# Altium project WiDSO.PrjPcb
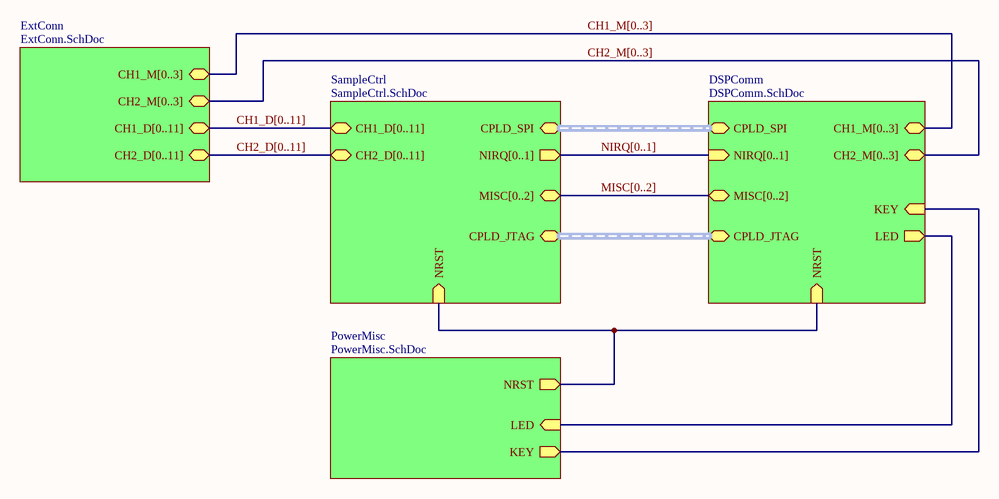
[diagram p0: WiDSO.SchDoc]
5 sheets, 45 parts. Net scope: hierarchical (ports join the sheet entries above them; power ports are global).
Board file: WiDSO.PcbDoc
Sheets:
  WiDSO.SchDoc
    ExtConn = ExtConn.SchDoc
    SampleCtrl = SampleCtrl.SchDoc
    DSPComm = DSPComm.SchDoc
    PowerMisc = PowerMisc.SchDoc

## Sheet WiDSO.SchDoc
size A4

### Sub-sheets
DSPComm = DSPComm.SchDoc: CPLD_SPI (harness SPI), NIRQ[0..1] (in), MISC[0..2] (bidir), CPLD_JTAG (harness JTAG), CH1_M[0..3] (bidir), CH2_M[0..3] (bidir), LED (out), KEY (in), NRST (in)
ExtConn = ExtConn.SchDoc: CH1_D[0..11] (bidir), CH2_D[0..11] (bidir), CH1_M[0..3] (bidir), CH2_M[0..3] (bidir)
PowerMisc = PowerMisc.SchDoc: LED (in), KEY (out), NRST (out)
SampleCtrl = SampleCtrl.SchDoc: CH1_D[0..11] (bidir), CH2_D[0..11] (bidir), CPLD_SPI (harness SPI), NIRQ[0..1] (out), MISC[0..2] (bidir), CPLD_JTAG (harness JTAG), NRST (in)

### Nets
NRST: sheet SampleCtrl/NRST, sheet DSPComm/NRST, sheet PowerMisc/NRST
NetC4_1: sheet DSPComm/KEY, sheet PowerMisc/KEY
NetU4_29: sheet DSPComm/LED, sheet PowerMisc/LED

### Buses and harness runs
bus CH1_D[0..11] = sheet ExtConn/CH1_D[0..11] = sheet SampleCtrl/CH1_D[0..11]
bus CH1_M[0..3] = sheet DSPComm/CH1_M[0..3] = sheet ExtConn/CH1_M[0..3]
bus CH2_D[0..11] = sheet ExtConn/CH2_D[0..11] = sheet SampleCtrl/CH2_D[0..11]
bus CH2_M[0..3] = sheet DSPComm/CH2_M[0..3] = sheet ExtConn/CH2_M[0..3]
bus MISC[0..2] = sheet DSPComm/MISC[0..2] = sheet SampleCtrl/MISC[0..2]
bus NIRQ[0..1] = sheet DSPComm/NIRQ[0..1] = sheet SampleCtrl/NIRQ[0..1]
harness sheet DSPComm/CPLD_JTAG = sheet SampleCtrl/CPLD_JTAG
harness sheet DSPComm/CPLD_SPI = sheet SampleCtrl/CPLD_SPI

## Sheet ExtConn.SchDoc
size A4
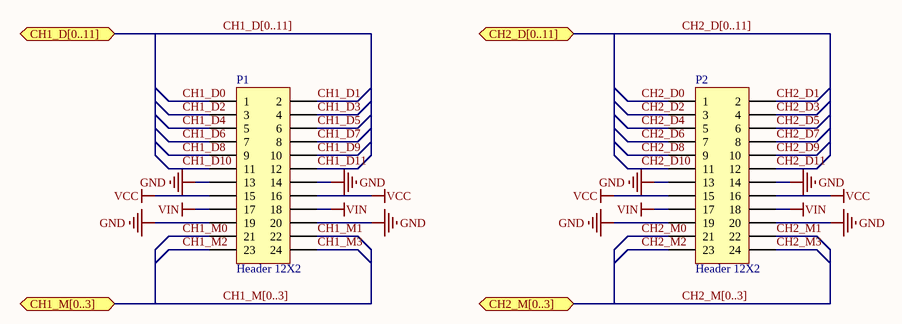
[diagram p1: ExtConn.SchDoc]

### Parts
P1  Header 12X2  [HDR2X12]
P2  Header 12X2  [HDR2X12]

### Ports
CH1_D[0..11] (bidir), CH1_M[0..3] (bidir), CH2_D[0..11] (bidir), CH2_M[0..3] (bidir)

### Nets
GND: P1.13 P1.14 P1.19 P1.20 P2.13 P2.14 P2.19 P2.20
VCC: P1.15 P1.16 P2.15 P2.16
VIN: P1.17 P1.18 P2.17 P2.18
CH1_D0: P1.1
CH1_D1: P1.2
CH1_D2: P1.3
CH1_D3: P1.4
CH1_D4: P1.5
CH1_D5: P1.6
CH1_D6: P1.7
CH1_D7: P1.8
CH1_D8: P1.9
CH1_D9: P1.10
CH1_D10: P1.11
CH1_D11: P1.12
CH1_M0: P1.21
CH1_M1: P1.22
CH1_M2: P1.23
CH1_M3: P1.24
CH2_D0: P2.1
CH2_D1: P2.2
CH2_D2: P2.3
CH2_D3: P2.4
CH2_D4: P2.5
CH2_D5: P2.6
CH2_D6: P2.7
CH2_D7: P2.8
CH2_D8: P2.9
CH2_D9: P2.10
CH2_D10: P2.11
CH2_D11: P2.12
CH2_M0: P2.21
CH2_M1: P2.22
CH2_M2: P2.23
CH2_M3: P2.24

### Buses and harness runs
bus CH1_D[0..11] = port CH1_D[0..11]
bus CH1_M[0..3] = port CH1_M[0..3]
bus CH2_D[0..11] = port CH2_D[0..11]
bus CH2_M[0..3] = port CH2_M[0..3]

### Library data of the parts
P1 P2 = Header 12X2: Header, 12-Pin, Dual row; LatestRevisionDate: 17-Jul-2002; LatestRevisionNote: Re-released for DXP Platform.; Publisher: Altium Limited

## Sheet SampleCtrl.SchDoc
size A4
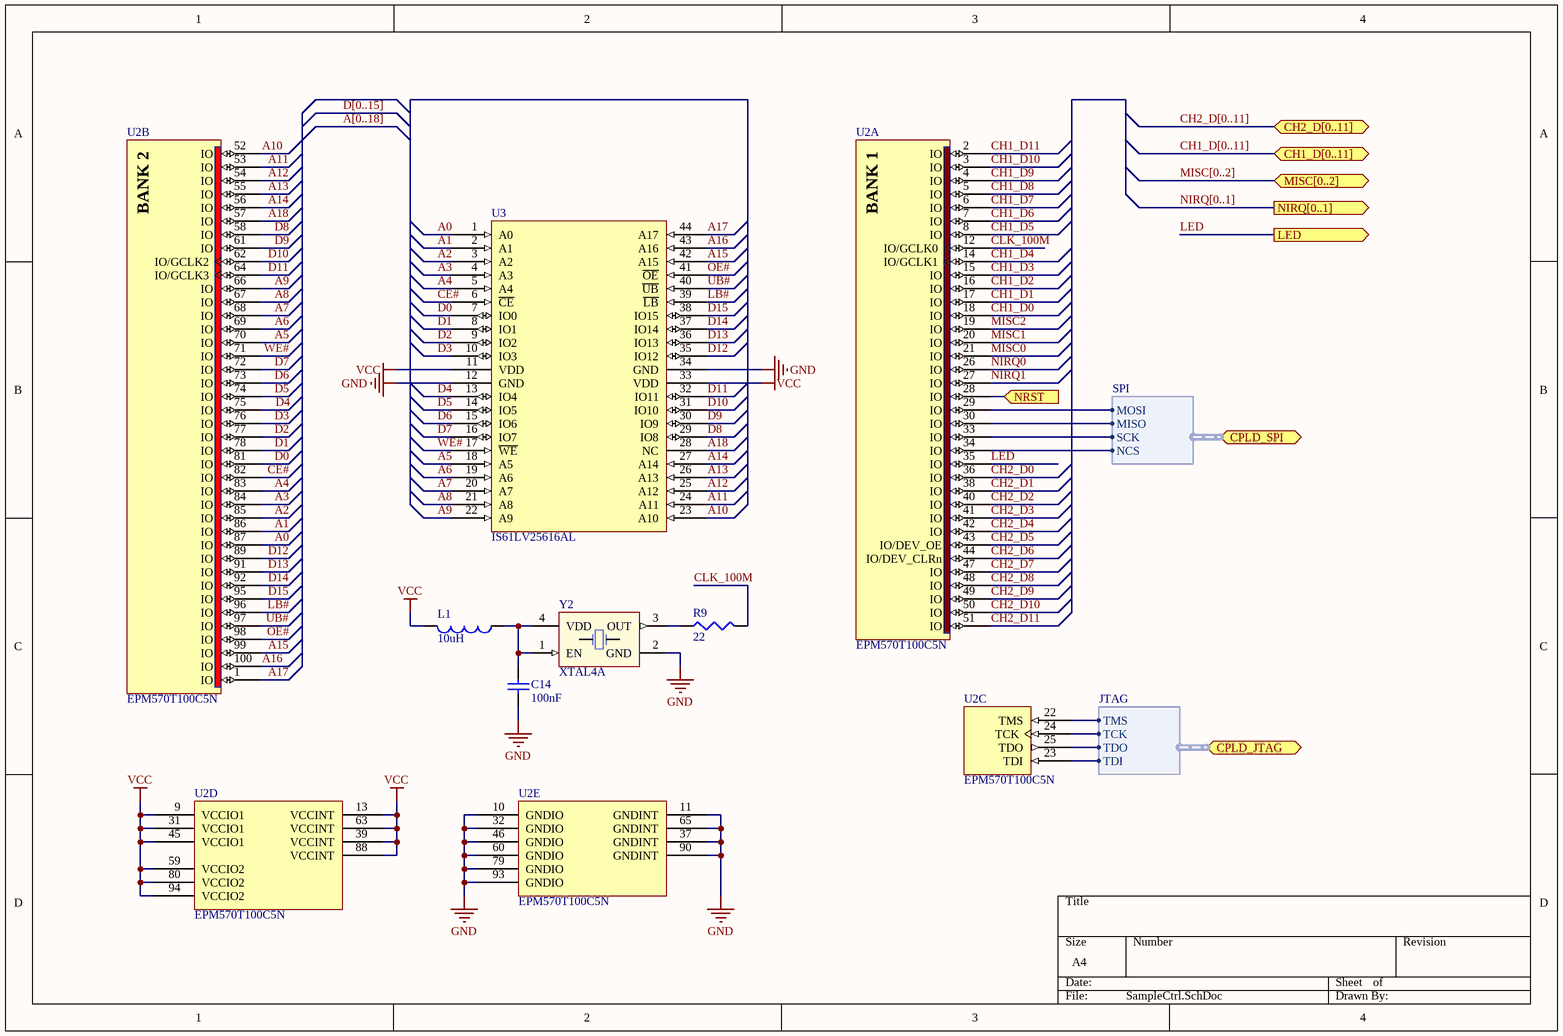
[diagram p2: SampleCtrl.SchDoc]

### Parts
C14  value 100nF  [0603C]  (hidden comment: Cap)
L1  value 10uH  [0805L]  (hidden comment: Inductor)
R9  value 22  [0603R]  (hidden comment: Res3)
U2  EPM570T100C5N  [TQFP100_N]  (parts A,B,C,D,E of 5)
U3  IS61LV25616AL  [TSOP-2L]
Y2  XTAL4A  [XTAL_7050_4P]

### Ports
CH1_D[0..11] (bidir), CH2_D[0..11] (bidir), CPLD_JTAG (harness JTAG), CPLD_SPI (harness SPI), LED (out), MISC[0..2] (bidir), NIRQ[0..1] (out), NRST (in)

### Harnesses
JTAG: TDI, TDO, TCK, TMS
SPI: MOSI, MISO, SCK, NCS

### Nets
GND: C14.2 U2.10(GNDIO) U2.11(GNDINT) U2.32(GNDIO) U2.37(GNDINT) U2.46(GNDIO) U2.60(GNDIO) U2.65(GNDINT) U2.79(GNDIO) U2.90(GNDINT) U2.93(GNDIO) U3.12(GND) U3.34(GND) Y2.2(GND)
VCC: L1.2 U2.9(VCCIO1) U2.13(VCCINT) U2.31(VCCIO1) U2.39(VCCINT) U2.45(VCCIO1) U2.59(VCCIO2) U2.63(VCCINT) U2.80(VCCIO2) U2.88(VCCINT) U2.94(VCCIO2) U3.11(VDD) U3.33(VDD)
A0: U2.87(IO) U3.1(A0)
A1: U2.86(IO) U3.2(A1)
A2: U2.85(IO) U3.3(A2)
A3: U2.84(IO) U3.4(A3)
A4: U2.83(IO) U3.5(A4)
A5: U2.70(IO) U3.18(A5)
A6: U2.69(IO) U3.19(A6)
A7: U2.68(IO) U3.20(A7)
A8: U2.67(IO) U3.21(A8)
A9: U2.66(IO) U3.22(A9)
A10: U2.52(IO) U3.23(A10)
A11: U2.53(IO) U3.24(A11)
A12: U2.54(IO) U3.25(A12)
A13: U2.55(IO) U3.26(A13)
A14: U2.56(IO) U3.27(A14)
A15: U2.99(IO) U3.42(A15)
A16: U2.100(IO) U3.43(A16)
A17: U2.1(IO) U3.44(A17)
A18: U2.57(IO) U3.28(NC)
CE#: U2.82(IO) U3.6(~{CE})
CH1_D0: U2.18(IO)
CH1_D1: U2.17(IO)
CH1_D2: U2.16(IO)
CH1_D3: U2.15(IO)
CH1_D4: U2.14(IO/GCLK1)
CH1_D5: U2.8(IO)
CH1_D6: U2.7(IO)
CH1_D7: U2.6(IO)
CH1_D8: U2.5(IO)
CH1_D9: U2.4(IO)
CH1_D10: U2.3(IO)
CH1_D11: U2.2(IO)
CH2_D0: U2.36(IO)
CH2_D1: U2.38(IO)
CH2_D2: U2.40(IO)
CH2_D3: U2.41(IO)
CH2_D4: U2.42(IO)
CH2_D5: U2.43(IO/DEV_OE)
CH2_D6: U2.44(IO/DEV_CLRn)
CH2_D7: U2.47(IO)
CH2_D8: U2.48(IO)
CH2_D9: U2.49(IO)
CH2_D10: U2.50(IO)
CH2_D11: U2.51(IO)
CLK_100M: R9.2 U2.12(IO/GCLK0)
D0: U2.81(IO) U3.7(IO0)
D1: U2.78(IO) U3.8(IO1)
D2: U2.77(IO) U3.9(IO2)
D3: U2.76(IO) U3.10(IO3)
D4: U2.75(IO) U3.13(IO4)
D5: U2.74(IO) U3.14(IO5)
D6: U2.73(IO) U3.15(IO6)
D7: U2.72(IO) U3.16(IO7)
D8: U2.58(IO) U3.29(IO8)
D9: U2.61(IO) U3.30(IO9)
D10: U2.62(IO/GCLK2) U3.31(IO10)
D11: U2.64(IO/GCLK3) U3.32(IO11)
D12: U2.89(IO) U3.35(IO12)
D13: U2.91(IO) U3.36(IO13)
D14: U2.92(IO) U3.37(IO14)
D15: U2.95(IO) U3.38(IO15)
LB#: U2.96(IO) U3.39(~{LB})
LED: U2.35(IO) ; port LED
MISC0: U2.21(IO)
MISC1: U2.20(IO)
MISC2: U2.19(IO)
NIRQ0: U2.26(IO)
NIRQ1: U2.27(IO)
NRST: U2.28(IO) ; port NRST
OE#: U2.98(IO) U3.41(~{OE})
UB#: U2.97(IO) U3.40(~{UB})
WE#: U2.71(IO) U3.17(~{WE})
NetC14_1: C14.1 L1.1 Y2.1(EN) Y2.4(VDD)
NetR9_1: R9.1 Y2.3(OUT)
NetU2_22: U2.22(TMS) ; port CPLD_JTAG.TMS
NetU2_23: U2.23(TDI) ; port CPLD_JTAG.TDI
NetU2_24: U2.24(TCK) ; port CPLD_JTAG.TCK
NetU2_25: U2.25(TDO) ; port CPLD_JTAG.TDO
NetU2_29: U2.29(IO) ; port CPLD_SPI.MOSI
NetU2_30: U2.30(IO) ; port CPLD_SPI.MISO
NetU2_33: U2.33(IO) ; port CPLD_SPI.SCK
NetU2_34: U2.34(IO) ; port CPLD_SPI.NCS

### Buses and harness runs
bus A[0..18]
bus CH1_D[0..11] = port CH1_D[0..11]
bus CH2_D[0..11] = port CH2_D[0..11]
bus D[0..15]
bus MISC[0..2] = port MISC[0..2]
bus NIRQ[0..1] = port NIRQ[0..1]

### Notes on the sheet
- (in symbol EPM570T100C5N, part A) BANK 1
- (in symbol EPM570T100C5N, part B) BANK 2

### Library data of the parts
C14 = Cap: Capacitor; Published: 8-Jun-2000; LatestRevisionDate: 17-Jul-2002; LatestRevisionNote: Re-released for DXP Platform.; PackageReference: CAPC2012L; Publisher: Altium Limited
L1 = Inductor: Code_IEC: 1005; Published: 8-Jun-2000; LatestRevisionDate: 29-May-2009; LatestRevisionNote: IPC-7351 Footprint Added.; PackageReference: 0402-A; Publisher: Altium Limited; PackageDescription: Chip Inductor; Code_JEITA: 0402
R9 = Res3: Resistor; Published: 8-Jun-2000; LatestRevisionDate: 29-May-2009; LatestRevisionNote: IPC-7351 Footprint Added.; PackageReference: J1-0603; Publisher: Altium Limited; PackageDescription: Chip Resistor
U2 = EPM570T100C5N: MAX II 3.3/2.5V CPLD, 76 IOs, 570 Logic Elements, 100-Pin Plastic TQFP, Commercial Temperature, Speed Grade 5, Pb-Free; Note: Each set of VCCIO pins can be connected to 3.3V, 2.5V, 1.8V, or 1.5V.; Note: All VCCINT pins must be connected to either 3.3V or 2.5V (but not a combination of both).; Published: 4-Mar-2005; LatestRevisionDate: 13-Apr-2006; LatestRevisionNote: IPC-7351 Footprint Added.; DatasheetVersion: ver1.8, Jul-2006; PackageVersion: ver14.3, Jul-2006; PackageReference: TQFP100; Publisher: Altium Limited; PackageDescription: 100-Pin Plastic Thin Quad Flat Pack (TQFP100); Code_JEDEC: MS-026-AED; ComponentLink1Description: Manufacturer Link; ComponentLink1URL: http://www.altera.com/products/devices/cpld/max2/mx2-index.jsp; ComponentLink2Description: Handbook; ComponentLink2URL: http://www.altera.com/literature/hb/max2/max2_mii5v1.pdf; ComponentLink3Description: Packaging Specification; ComponentLink3URL: http://www.altera.com/literature/ds/dspkg.pdf
U3 = IS61LV25616AL: 256K*16 SRAM, 3.3V
Y2 = XTAL4A: 4脚有源晶振

## Sheet DSPComm.SchDoc
size A4
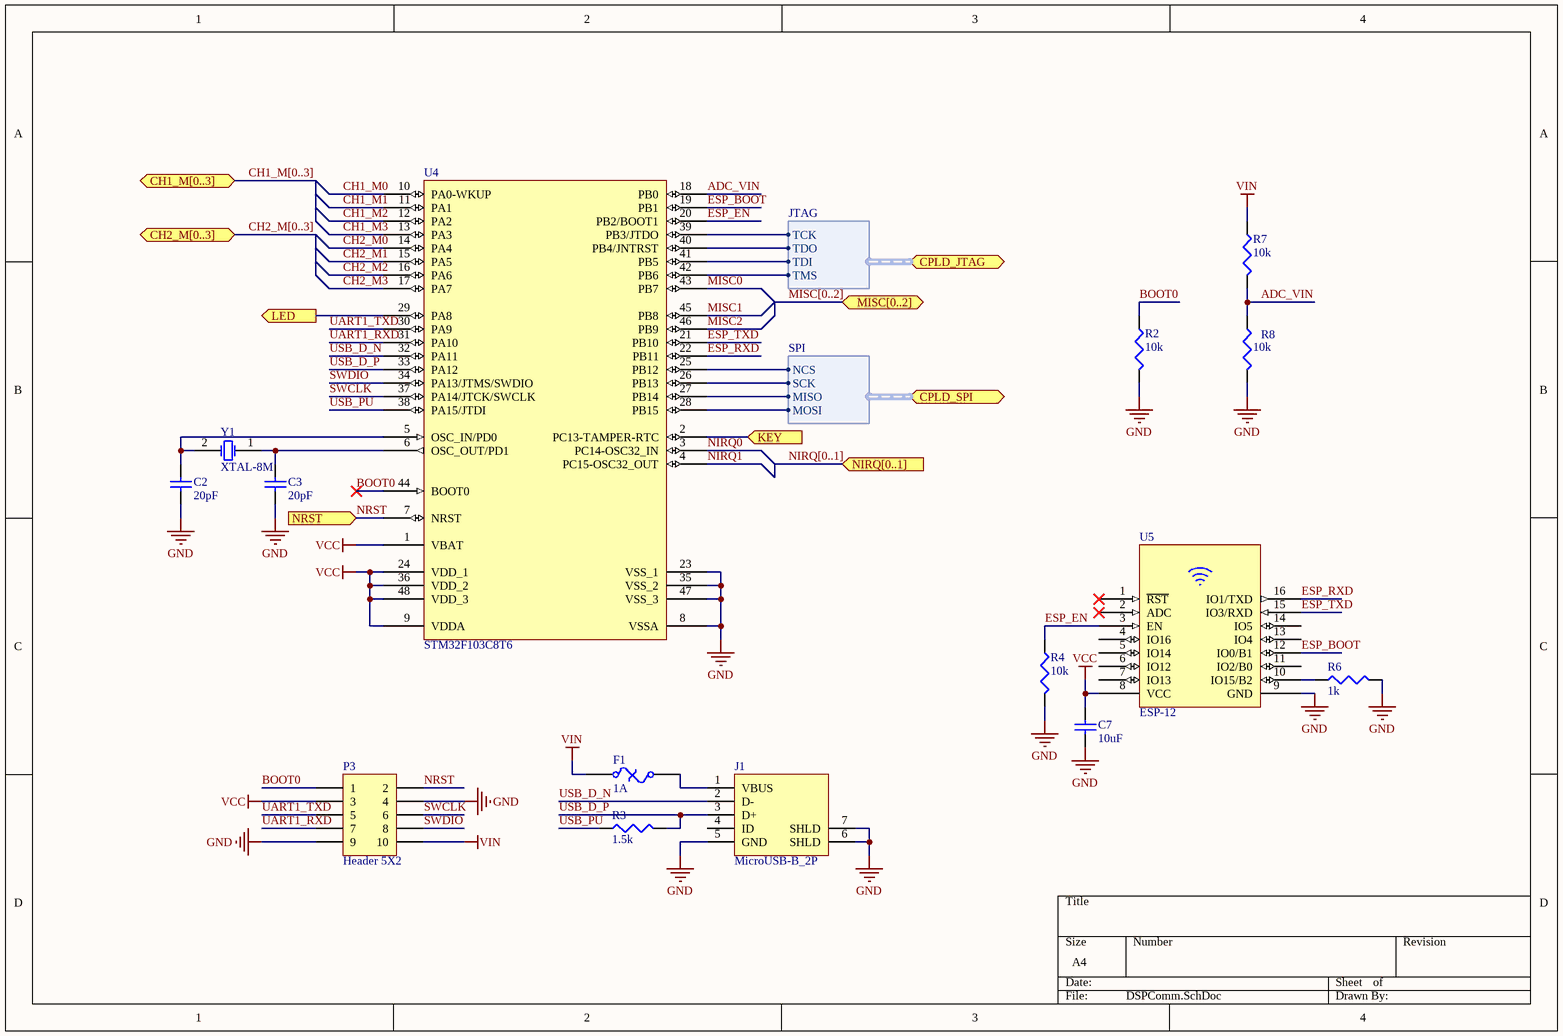
[diagram p3: DSPComm.SchDoc]

### Parts
(Parts that share a designator on the sheet are numbered #1, #2 ... from top to bottom, then left to right.)
C2  value 20pF  [0603C]  (hidden comment: Cap)
C3  value 20pF  [0603C]  (hidden comment: Cap)
C7#1  value 10uF  [0805C]  (hidden comment: Cap)
F1  1A  [1206F]
J1  MicroUSB-B_2P  [MICRO-USB-B-2P]
P3  Header 5X2  [HDR2X5]
R2  value 10k  [0603R]  (hidden comment: Res3)
R3  value 1.5k  [0603R]  (hidden comment: Res3)
R4  value 10k  [0603R]  (hidden comment: Res3)
R6  value 1k  [0603R]  (hidden comment: Res3)
R7  value 10k  [0603R]  (hidden comment: Res3)
R8  value 10k  [0603R]  (hidden comment: Res3)
U4  STM32F103C8T6  [LQFP48_M]
U5  ESP-12  [ESP-12]
Y1  XTAL-8M  [XTAL_5032_2P]

### Ports
CH1_M[0..3] (bidir), CH2_M[0..3] (bidir), CPLD_JTAG (harness JTAG), CPLD_SPI (harness SPI), KEY (in), LED (out), MISC[0..2] (bidir), NIRQ[0..1] (in), NRST (in)

### Harnesses
JTAG: TDI, TDO, TCK, TMS
SPI: MOSI, MISO, SCK, NCS

### Nets
GND: C2.1 C3.1 C7#1.2 J1.5(GND) J1.6(SHLD) J1.7(SHLD) P3.4 P3.9 R2.2 R4.2 R6.2 R8.2 U4.8(VSSA) U4.23(VSS_1) U4.35(VSS_2) U4.47(VSS_3) U5.9(GND)
VCC: C7#1.1 P3.3 U4.1(VBAT) U4.9(VDDA) U4.24(VDD_1) U4.36(VDD_2) U4.48(VDD_3) U5.8(VCC)
VIN: F1.1 P3.10 R7.1
ADC_VIN: R7.2 R8.1 U4.18(PB0)
BOOT0: P3.1 R2.1 U4.44(BOOT0)
CH1_M0: U4.10(PA0-WKUP)
CH1_M1: U4.11(PA1)
CH1_M2: U4.12(PA2)
CH1_M3: U4.13(PA3)
CH2_M0: U4.14(PA4)
CH2_M1: U4.15(PA5)
CH2_M2: U4.16(PA6)
CH2_M3: U4.17(PA7)
ESP_BOOT: U4.19(PB1) U5.12(IO0/B1)
ESP_EN: R4.1 U4.20(PB2/BOOT1) U5.3(EN)
ESP_RXD: U4.22(PB11) U5.16(IO1/TXD)
ESP_TXD: U4.21(PB10) U5.15(IO3/RXD)
MISC0: U4.43(PB7)
MISC1: U4.45(PB8)
MISC2: U4.46(PB9)
NIRQ0: U4.3(PC14-OSC32_IN)
NIRQ1: U4.4(PC15-OSC32_OUT)
NRST: P3.2 U4.7(NRST) ; port NRST
SWCLK: P3.6 U4.37(PA14/JTCK/SWCLK)
SWDIO: P3.8 U4.34(PA13/JTMS/SWDIO)
UART1_RXD: P3.7 U4.31(PA10)
UART1_TXD: P3.5 U4.30(PA9)
USB_D_N: J1.2(D-) U4.32(PA11)
USB_D_P: J1.3(D+) R3.2 U4.33(PA12)
USB_PU: R3.1 U4.38(PA15/JTDI)
NetC2_2: C2.2 U4.5(OSC_IN/PD0) Y1.2(OSC2)
NetC3_2: C3.2 U4.6(OSC_OUT/PD1) Y1.1(OSC1)
NetC4_1: U4.2(PC13-TAMPER-RTC) ; port KEY
NetF1_2: F1.2 J1.1(VBUS)
NetR6_1: R6.1 U5.10(IO15/B2)
NetU2_22: U4.42(PB6) ; port CPLD_JTAG.TMS
NetU2_23: U4.41(PB5) ; port CPLD_JTAG.TDI
NetU2_24: U4.39(PB3/JTDO) ; port CPLD_JTAG.TCK
NetU2_25: U4.40(PB4/JNTRST) ; port CPLD_JTAG.TDO
NetU2_29: U4.28(PB15) ; port CPLD_SPI.MOSI
NetU2_30: U4.27(PB14) ; port CPLD_SPI.MISO
NetU2_33: U4.26(PB13) ; port CPLD_SPI.SCK
NetU2_34: U4.25(PB12) ; port CPLD_SPI.NCS
NetU4_29: U4.29(PA8) ; port LED

Not connected (* = marked no-connect by the designer): J1 4(ID); U5 1(~{RST})* 2(ADC)* 4(IO16) 5(IO14) 6(IO12) 7(IO13) 11(IO2/B0) 13(IO4) 14(IO5)

### Buses and harness runs
bus CH1_M[0..3] = port CH1_M[0..3]
bus CH2_M[0..3] = port CH2_M[0..3]
bus MISC[0..2] = port MISC[0..2]
bus NIRQ[0..1] = port NIRQ[0..1]

### Library data of the parts
C2 C3 C7#1 = Cap: Capacitor; Published: 8-Jun-2000; LatestRevisionDate: 17-Jul-2002; LatestRevisionNote: Re-released for DXP Platform.; PackageReference: CAPC2012L; Publisher: Altium Limited
F1 = Fuse Thermal: Thermal Fuse; Published: 24-Mar-1999; LatestRevisionDate: 17-Jul-2002; LatestRevisionNote: Re-released for DXP Platform.; PackageReference: PIN-W2/E2.8; Publisher: Altium Limited; PackageDescription: Thru-Hole; 2 Leads
J1 = MicroUSB-B_2P: MicroUSB母座
P3 = Header 5X2: Header, 5-Pin, Dual row; LatestRevisionDate: 17-Jul-2002; LatestRevisionNote: Re-released for DXP Platform.; Publisher: Altium Limited
R2-R4 R6-R8 = Res3: Resistor; Published: 8-Jun-2000; LatestRevisionDate: 29-May-2009; LatestRevisionNote: IPC-7351 Footprint Added.; PackageReference: J1-0603; Publisher: Altium Limited; PackageDescription: Chip Resistor
U4 = STM32F103C8T6: STM32 ARM-based 32-bit MCU with 64 Kbytes Flash, 48-pin LQFP, Industrial Temperature; Published: 30-May-2008; DatasheetVersion: rev6, Mar-2008; PackageVersion: Mar-2008; PackageReference: LQFP48; Publisher: Altium Limited; PackageDescription: 48-Pin Low-Profile Quad Flat Pack, 7 x 7 mm Body, 0.5 mm Pitch (LQFP48); ComponentLink1Description: Manufacturer Link; ComponentLink1URL: www.st.com/stm32; ComponentLink2Description: Datasheet; ComponentLink2URL: http://www.st.com/stonline/products/literature/ds/13587.pdf
U5 = ESP-12: 串口Wifi模块
Y1 = XTAL: Crystal Oscillator; Published: 8-Jun-2000; LatestRevisionDate: 17-Jul-2002; LatestRevisionNote: Re-released for DXP Platform.; PackageReference: R38; Publisher: Altium Limited; PackageDescription: Crystal, Thru-Hole; 2 Leads; Body 3.1 x 8.2 mm (Dia.xH)

## Sheet PowerMisc.SchDoc
size A4
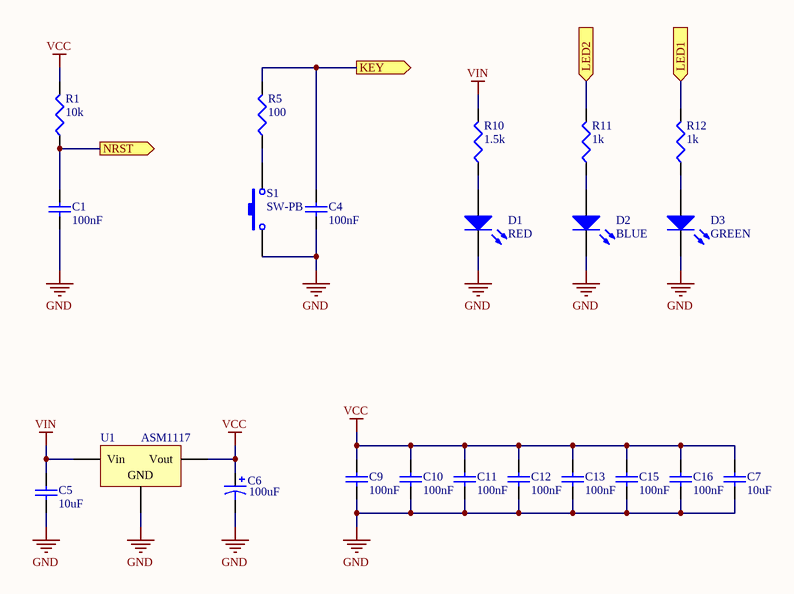
[diagram p4: PowerMisc.SchDoc]

### Parts
(Parts that share a designator on the sheet are numbered #1, #2 ... from top to bottom, then left to right.)
C1  value 100nF  [0603C]  (hidden comment: Cap)
C4  value 100nF  [0603C]  (hidden comment: Cap)
C5  value 10uF  [1206C]  (hidden comment: Cap)
C6  value 100uF  [CAP3528T]  (hidden comment: Cap Pol3)
C7#2  value 10uF  [0805C]  (hidden comment: Cap)
C9  value 100nF  [0603C]  (hidden comment: Cap)
C10  value 100nF  [0603C]  (hidden comment: Cap)
C11  value 100nF  [0603C]  (hidden comment: Cap)
C12  value 100nF  [0603C]  (hidden comment: Cap)
C13  value 100nF  [0603C]  (hidden comment: Cap)
C15  value 100nF  [0603C]  (hidden comment: Cap)
C16  value 100nF  [0603C]  (hidden comment: Cap)
D1  RED  [0603LED]
D2  BLUE  [0603LED]
D3  GREEN  [0603LED]
R1  value 10k  [0603R]  (hidden comment: Res3)
R5  value 100  [0603R]  (hidden comment: Res3)
R10  value 1.5k  [0603R]  (hidden comment: Res3)
R11  value 1k  [0603R]  (hidden comment: Res3)
R12  value 1k  [0603R]  (hidden comment: Res3)
S1  SW-PB  [SPST-SM2]
U1  ASM1117  [SOT223]

### Ports
KEY (out), LED1 (in), LED2 (in), NRST (out)

### Nets
GND: C1.2 C4.2 C5.2 C6.2 C7#2.2 C9.2 C10.2 C11.2 C12.2 C13.2 C15.2 C16.2 D1.2(K) D2.2(K) D3.2(K) S1.1 U1.2(GND)
VCC: C6.1 C7#2.1 C9.1 C10.1 C11.1 C12.1 C13.1 C15.1 C16.1 R1.2 U1.3(Vout)
VIN: C5.1 R10.2 U1.1(Vin)
NRST: C1.1 R1.1 ; port NRST
NetC4_1: C4.1 R5.2 ; port KEY
NetD1_1: D1.1(A) R10.1
NetD2_1: D2.1(A) R11.1
NetD3_1: D3.1(A) R12.1
NetR5_1: R5.1 S1.2
NetR11_2: R11.2 ; port LED2
NetR12_2: R12.2 ; port LED1

### Library data of the parts
C1 C4 C5 C7#2 C9-C13 C15 C16 = Cap: Capacitor; Published: 8-Jun-2000; LatestRevisionDate: 17-Jul-2002; LatestRevisionNote: Re-released for DXP Platform.; PackageReference: CAPC2012L; Publisher: Altium Limited
C6 = Cap Pol3: Polarized Capacitor (Surface Mount); Published: 8-Jun-2000; LatestRevisionDate: 29-May-2009; LatestRevisionNote: IPC-7351 Footprint Added.; PackageReference: C0805; Publisher: Altium Limited; PackageDescription: Chip Capacitor
D1-D3 = LED1: Typical RED GaAs LED; Published: 8-Jun-2000; LatestRevisionDate: 08-Jul-2005; LatestRevisionNote: Mech Layer 1 removed.; PackageReference: LED-1; Publisher: Altium Limited
R1 R5 R10-R12 = Res3: Resistor; Published: 8-Jun-2000; LatestRevisionDate: 29-May-2009; LatestRevisionNote: IPC-7351 Footprint Added.; PackageReference: J1-0603; Publisher: Altium Limited; PackageDescription: Chip Resistor
S1 = SW-PB: Switch; Published: 24-Mar-1999; LatestRevisionDate: 17-Jul-2002; LatestRevisionNote: Re-released for DXP Platform.; PackageReference: SPST-2; Publisher: Altium Limited
U1 = Volt Reg: Voltage Regulator; pin to pad: 1>3 2>1+4 3>2; Published: 24-Mar-1999; LatestRevisionDate: 29-May-2009; LatestRevisionNote: IPC-7351 Footprint Added.; PackageReference: D2PAK; Publisher: Altium Limited; PackageDescription: 3-Pin Transistor Outline Package 2.54 mm Pitch, 15.1 mm Lead Span

## Nets that join several sheets
GND: ExtConn (8 pins), SampleCtrl (14 pins), DSPComm (17 pins), PowerMisc (17 pins)
VCC: ExtConn (P1.15 P1.16 P2.15 P2.16), SampleCtrl (13 pins), DSPComm (8 pins), PowerMisc (11 pins)
VIN: ExtConn (P1.17 P1.18 P2.17 P2.18), DSPComm (F1.1 P3.10 R7.1), PowerMisc (C5.1 R10.2 U1.1)
CH1_D0: ExtConn (P1.1), SampleCtrl (U2.18)
CH1_D1: ExtConn (P1.2), SampleCtrl (U2.17)
CH1_D2: ExtConn (P1.3), SampleCtrl (U2.16)
CH1_D3: ExtConn (P1.4), SampleCtrl (U2.15)
CH1_D4: ExtConn (P1.5), SampleCtrl (U2.14)
CH1_D5: ExtConn (P1.6), SampleCtrl (U2.8)
CH1_D6: ExtConn (P1.7), SampleCtrl (U2.7)
CH1_D7: ExtConn (P1.8), SampleCtrl (U2.6)
CH1_D8: ExtConn (P1.9), SampleCtrl (U2.5)
CH1_D9: ExtConn (P1.10), SampleCtrl (U2.4)
CH1_D10: ExtConn (P1.11), SampleCtrl (U2.3)
CH1_D11: ExtConn (P1.12), SampleCtrl (U2.2)
CH1_M0: ExtConn (P1.21), DSPComm (U4.10)
CH1_M1: ExtConn (P1.22), DSPComm (U4.11)
CH1_M2: ExtConn (P1.23), DSPComm (U4.12)
CH1_M3: ExtConn (P1.24), DSPComm (U4.13)
CH2_D0: ExtConn (P2.1), SampleCtrl (U2.36)
CH2_D1: ExtConn (P2.2), SampleCtrl (U2.38)
CH2_D2: ExtConn (P2.3), SampleCtrl (U2.40)
CH2_D3: ExtConn (P2.4), SampleCtrl (U2.41)
CH2_D4: ExtConn (P2.5), SampleCtrl (U2.42)
CH2_D5: ExtConn (P2.6), SampleCtrl (U2.43)
CH2_D6: ExtConn (P2.7), SampleCtrl (U2.44)
CH2_D7: ExtConn (P2.8), SampleCtrl (U2.47)
CH2_D8: ExtConn (P2.9), SampleCtrl (U2.48)
CH2_D9: ExtConn (P2.10), SampleCtrl (U2.49)
CH2_D10: ExtConn (P2.11), SampleCtrl (U2.50)
CH2_D11: ExtConn (P2.12), SampleCtrl (U2.51)
CH2_M0: ExtConn (P2.21), DSPComm (U4.14)
CH2_M1: ExtConn (P2.22), DSPComm (U4.15)
CH2_M2: ExtConn (P2.23), DSPComm (U4.16)
CH2_M3: ExtConn (P2.24), DSPComm (U4.17)
MISC0: SampleCtrl (U2.21), DSPComm (U4.43)
MISC1: SampleCtrl (U2.20), DSPComm (U4.45)
MISC2: SampleCtrl (U2.19), DSPComm (U4.46)
NetC4_1: DSPComm (U4.2), PowerMisc (C4.1 R5.2)
NetU2_22: SampleCtrl (U2.22), DSPComm (U4.42)
NetU2_23: SampleCtrl (U2.23), DSPComm (U4.41)
NetU2_24: SampleCtrl (U2.24), DSPComm (U4.39)
NetU2_25: SampleCtrl (U2.25), DSPComm (U4.40)
NetU2_29: SampleCtrl (U2.29), DSPComm (U4.28)
NetU2_30: SampleCtrl (U2.30), DSPComm (U4.27)
NetU2_33: SampleCtrl (U2.33), DSPComm (U4.26)
NetU2_34: SampleCtrl (U2.34), DSPComm (U4.25)
NIRQ0: SampleCtrl (U2.26), DSPComm (U4.3)
NIRQ1: SampleCtrl (U2.27), DSPComm (U4.4)
NRST: SampleCtrl (U2.28), DSPComm (P3.2 U4.7), PowerMisc (C1.1 R1.1)